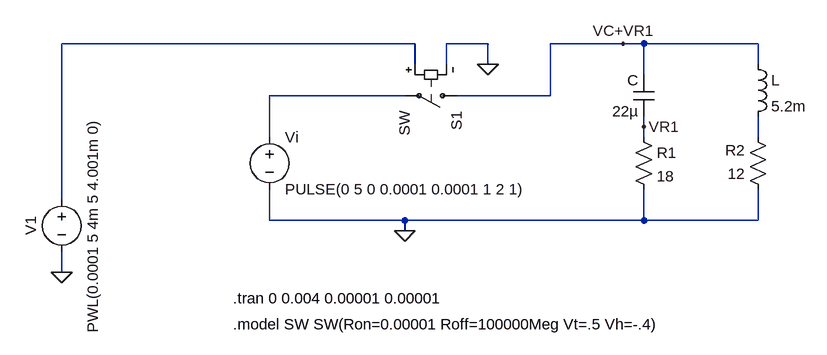
[diagram p0: schematic Draft1.asc]
Draft1.asc, the LTspice schematic file:
Version 4
SHEET 1 880 680
WIRE 0 0 -544 0
WIRE 112 0 48 0
WIRE 320 0 208 0
WIRE 352 0 320 0
WIRE 528 0 352 0
WIRE 0 32 0 0
WIRE 48 32 48 0
WIRE 112 32 112 0
WIRE 528 32 528 0
WIRE 352 48 352 0
WIRE -16 80 -224 80
WIRE 208 80 208 0
WIRE 208 80 64 80
WIRE 352 128 352 112
WIRE -224 144 -224 80
WIRE 352 144 352 128
WIRE 528 144 528 112
WIRE -544 240 -544 0
WIRE -224 272 -224 224
WIRE -16 272 -224 272
WIRE 352 272 352 224
WIRE 352 272 -16 272
WIRE 528 272 528 224
WIRE 528 272 352 272
WIRE -16 288 -16 272
WIRE -544 352 -544 320
FLAG -16 288 0
FLAG -544 352 0
FLAG 112 32 0
FLAG 320 0 VC+VR1
FLAG 352 128 VR1
SYMBOL voltage -224 128 R0
WINDOW 123 0 0 Left 2
WINDOW 39 0 0 Left 2
SYMATTR InstName Vi
SYMATTR Value PULSE(0 5 0 0.0001 0.0001 1 2 1)
SYMBOL cap 368 112 R180
WINDOW 0 24 56 Left 2
WINDOW 3 24 8 Left 2
SYMATTR InstName C
SYMATTR Value 22µ
SYMBOL res 544 240 R180
WINDOW 0 36 76 Left 2
WINDOW 3 36 40 Left 2
SYMATTR InstName R2
SYMATTR Value 12
SYMBOL ind 512 16 R0
SYMATTR InstName L
SYMATTR Value 5.2m
SYMBOL voltage -544 224 R0
WINDOW 0 -32 56 VBottom 2
WINDOW 3 32 56 VTop 2
WINDOW 123 0 0 Left 2
WINDOW 39 0 0 Left 2
SYMATTR InstName V1
SYMATTR Value PWL(0.0001 5 4m 5 4.001m 0)
SYMBOL sw 80 80 R90
SYMATTR InstName S1
SYMBOL res 336 128 R0
SYMATTR InstName R1
SYMATTR Value 18
TEXT -280 392 Left 2 !.tran 0 0.004 0.00001 0.00001
TEXT -280 432 Left 2 !.model SW SW(Ron=0.00001 Roff=100000Meg Vt=.5 Vh=-.4)

The netlist it stands for:
* Draft1.asc
Vi N002 0 PULSE(0 5 0 0.0001 0.0001 1 2 1)
C VR1 VC+VR1 22µ
R2 0 N003 12
L VC+VR1 N003 5.2m
V1 N001 0 PWL(0.0001 5 4m 5 4.001m 0)
S1 VC+VR1 N002 N001 0 SW
R1 VR1 0 18
.tran 0 0.004 0.00001 0.00001
.model SW SW(Ron=0.00001 Roff=100000Meg Vt=.5 Vh=-.4)
.backanno
.end

* Results of the author's LTspice run, read from the files saved beside the schematic
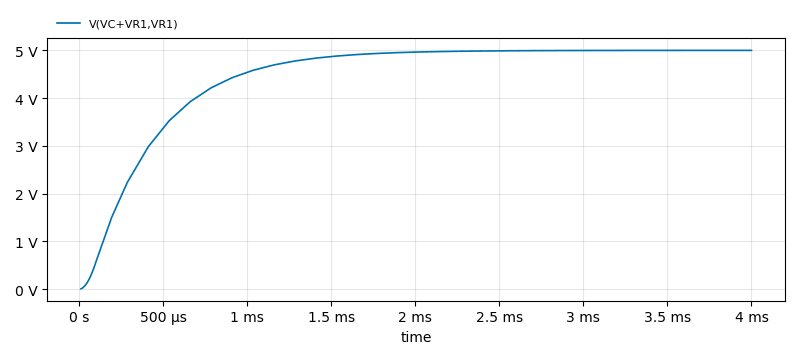
[diagram p1: Transient Analysis of Draft1.asc, plotted from the saved traces]
* Transient Analysis, 1 run:
*   V(VC+VR1,VR1): min 6.258 mV, max 5 V, average 4.451 V, rms 4.584 V, last 5 V